# Altium schematic sheet Ethernet_LAN8720_simple.SchDoc
size A4
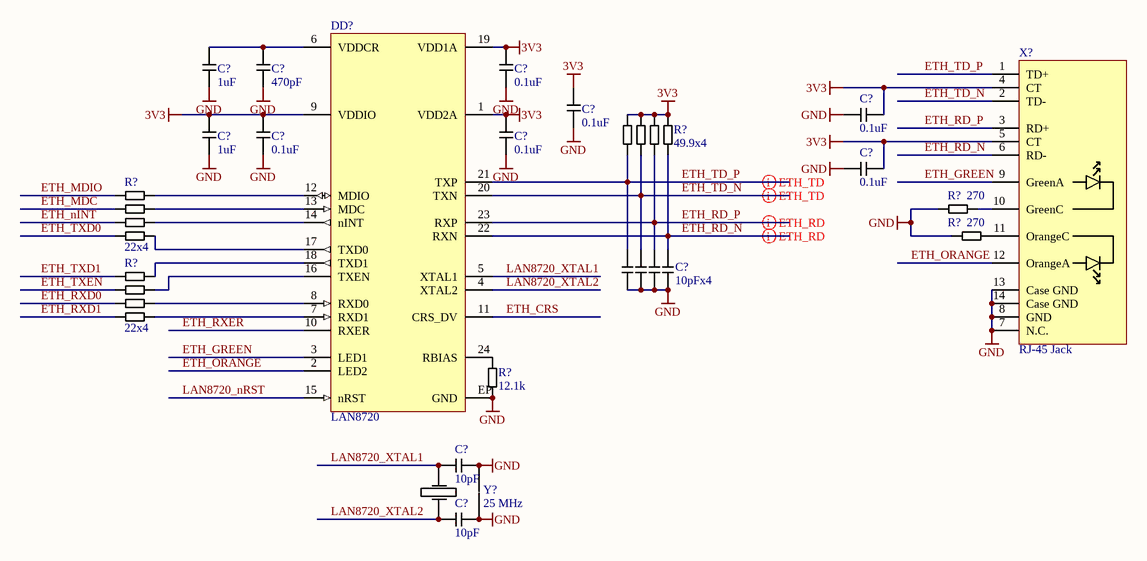
[diagram p0: Ethernet_LAN8720_simple.SchDoc]

## Parts
(Parts that share a designator on the sheet are numbered #1, #2 ... from top to bottom, then left to right.)
C?#1  1uF  [C0603]
C?#2  470pF  [C0603]
C?#3  0.1uF  [C0603]
C?#4  0.1uF  [C0603]
C?#5  0.1uF  [C0603]
C?#6  1uF  [C0603]
C?#7  0.1uF  [C0603]
C?#8  0.1uF  [C0603]
C?#9  0.1uF  [C0603]
C?#10  10pFx4  [C0612-4]
C?#11  10pF  [C0603]
C?#12  10pF  [C0603]
DD?  LAN8720  [QFN-24]
R?#1  49.9x4  [R0612-4]
R?#2  22x4  [R0612-4]
R?#3  270  [R0603]
R?#4  270  [R0603]
R?#5  22x4  [R0612-4]
R?#6  12.1k  [R0603]
X?  RJ-45 Jack  [J011D21BNL]
Y?  25 MHz  [Xtal 0532]

## Nets
3V3: C?#3.1 C?#4.2 C?#5.2 C?#6.1 C?#7.1 C?#8.1 C?#9.2 DD?.1(VDD2A) DD?.9(VDDIO) DD?.19(VDD1A) R?#1.1 R?#1.2 R?#1.3 R?#1.4 X?.4(CT) X?.5(CT)
GND: C?#1.2 C?#2.2 C?#3.2 C?#4.1 C?#5.1 C?#6.2 C?#7.2 C?#8.2 C?#9.1 C?#10.5 C?#10.6 C?#10.7 C?#10.8 C?#11.2 C?#12.2 DD?.EP(GND) R?#3.1 R?#4.1 R?#6.1 X?.7(N.C.) X?.8(GND) X?.13(Case_GND) X?.14(Case_GND) Y?.1(X1) Y?.3(X2)
ETH_CRS: DD?.11(CRS_DV)
ETH_GREEN: DD?.3(LED1) X?.9(GreenA)
ETH_MDC: R?#2.3
ETH_MDIO: R?#2.4
ETH_nINT: R?#2.2
ETH_ORANGE: DD?.2(LED2) X?.12(OrangeA)
ETH_RD_N: C?#10.4 DD?.22(RXN) R?#1.5 X?.6(RD-)
ETH_RD_P: C?#10.3 DD?.23(RXP) R?#1.6 X?.3(RD+)
ETH_RXD0: R?#5.2
ETH_RXD1: R?#5.1
ETH_RXER: DD?.10(RXER)
ETH_TD_N: C?#10.2 DD?.20(TXN) R?#1.7 X?.2(TD-)
ETH_TD_P: C?#10.1 DD?.21(TXP) R?#1.8 X?.1(TD+)
ETH_TXD0: R?#2.1
ETH_TXD1: R?#5.4
ETH_TXEN: R?#5.3
LAN8720_nRST: DD?.15(nRST)
LAN8720_XTAL1: C?#11.1 DD?.5(XTAL1) Y?.4(GND)
LAN8720_XTAL2: C?#12.1 DD?.4(XTAL2) Y?.2(GND)
NetC?#1_1: C?#1.1 C?#2.1 DD?.6(VDDCR)
NetDD?_7: DD?.7(RXD1) R?#5.8
NetDD?_8: DD?.8(RXD0) R?#5.7
NetDD?_12: DD?.12(MDIO) R?#2.5
NetDD?_13: DD?.13(MDC) R?#2.6
NetDD?_14: DD?.14(nINT) R?#2.7
NetDD?_16: DD?.16(TXEN) R?#5.6
NetDD?_17: DD?.17(TXD0) R?#2.8
NetDD?_18: DD?.18(TXD1) R?#5.5
NetDD?_24: DD?.24(RBIAS) R?#6.2
NetR?#3_2: R?#3.2 X?.10(GreenC)
NetR?#4_2: R?#4.2 X?.11(OrangeC)

## Layout directives
differential pair: ETH_RD_N, ETH_RD_P, ETH_TD_N, ETH_TD_P

## Library data of the parts
C?#1-C?#9 C?#11 C?#12 = C: Capacitor
C?#10 = Cx4: Capacitors array
DD? = LAN8720: Ethernet PHY
R?#1 R?#2 R?#5 = Rx4: Resistors array
R?#3 R?#4 R?#6 = R: Resistor
X? = RJ-45 Jack: Ethernet jack
Y? = Xtal: Quartz crystal